# Altium schematic sheet EthIO_04_RS485.SchDoc
size A4; SheetNumber: 8; SheetTotal: 8
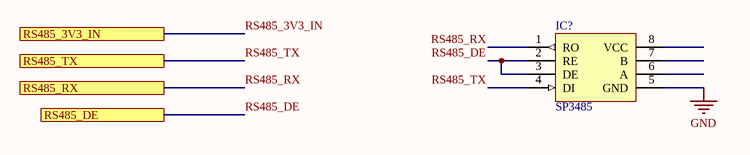
[diagram p0: EthIO_04_RS485.SchDoc]

## Parts
IC?  SP3485  [SOP8_N]

## Ports
RS485_3V3_IN, RS485_DE, RS485_RX, RS485_TX

## Nets
GND: IC?.5(GND)
RS485_3V3_IN: port RS485_3V3_IN
RS485_DE: IC?.2(RE) IC?.3(DE) ; port RS485_DE
RS485_RX: IC?.1(RO) ; port RS485_RX
RS485_TX: IC?.4(DI) ; port RS485_TX

Not connected (* = marked no-connect by the designer): IC? 6(A) 7(B) 8(VCC)

## Library data of the parts
IC? = SP3485: RS485总线收发芯片; 封装库来自淘宝卖家：黄晶宝石: 其他店铺购入均为盗版封装库，无更新权益，退款现金奖励200~1000元; 当前库版本V2022.12.25 @淘宝卖家:黄晶宝石: 最新版本发布https://shop463601444.taobao.com; BOM名称: RS485总线收发芯片